# Altium schematic sheet Sheet1.SchDoc
size A
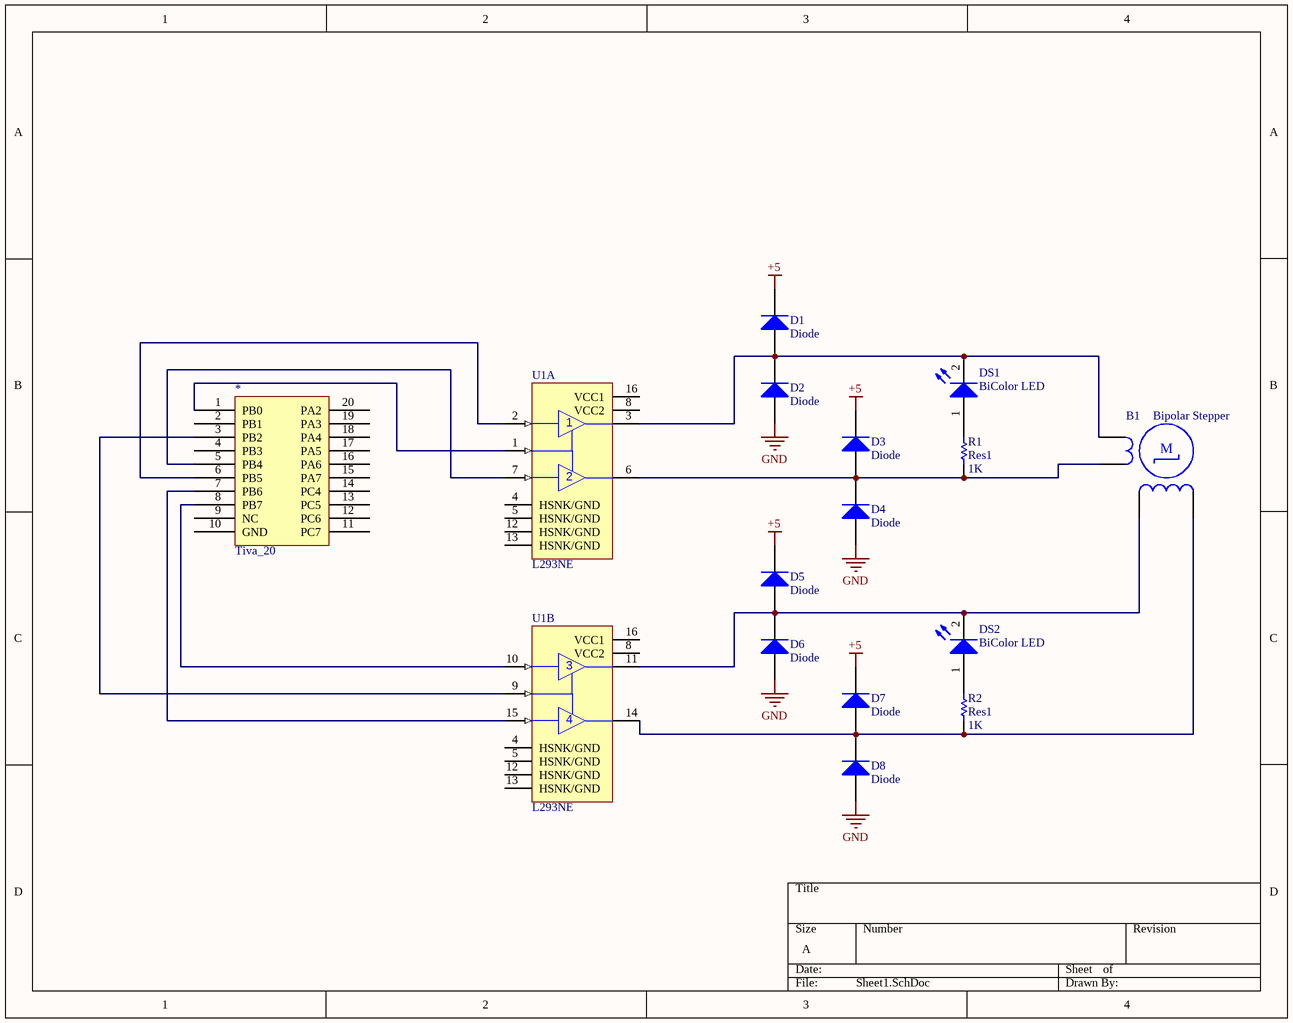
[diagram p0: Sheet1.SchDoc]

## Parts
*  Tiva_20
B1  Bipolar Stepper  [DIP-6]
D1  Diode  [DSO-C2/X3.3]
D2  Diode  [DSO-C2/X3.3]
D3  Diode  [DSO-C2/X3.3]
D4  Diode  [DSO-C2/X3.3]
D5  Diode  [DSO-C2/X3.3]
D6  Diode  [DSO-C2/X3.3]
D7  Diode  [DSO-C2/X3.3]
D8  Diode  [DSO-C2/X3.3]
DS1  BiColor LED  [LED-0]
DS2  BiColor LED  [LED-0]
R1  Res1  value 1K  [AXIAL-0.3]
R2  Res1  value 1K  [AXIAL-0.3]
U1  L293NE  [DIP-16/X1.5]  (parts A,B of 2)

## Nets
+5: D1.2(K) D3.2(K) D5.2(K) D7.2(K)
GND: D2.1(A) D4.1(A) D6.1(A) D8.1(A)
Net*_1: *.1(PB0) U1.1(1,2EN)
Net*_3: *.3(PB2) U1.9(3,4EN)
Net*_5: *.5(PB4) U1.7(2A)
Net*_6: *.6(PB5) U1.2(1A)
Net*_7: *.7(PB6) U1.15(4A)
Net*_8: *.8(PB7) U1.10(3A)
NetB1_1: B1.1 D1.1(A) D2.2(K) DS1.2(K) U1.3(1Y)
NetB1_3: B1.3 D3.1(A) D4.2(K) R1.1 U1.6(2Y)
NetB1_4: B1.4 D5.1(A) D6.2(K) DS2.2(K) U1.11(3Y)
NetB1_6: B1.6 D7.1(A) D8.2(K) R2.1 U1.14(4Y)
NetDS1_1: DS1.1(A) R1.2
NetDS2_1: DS2.1(A) R2.2

Not connected (* = marked no-connect by the designer): * 2(PB1) 4(PB3) 9(NC) 10(GND) 11(PC7) 12(PC6) 13(PC5) 14(PC4) 15(PA7) 16(PA6) 17(PA5) 18(PA4) 19(PA3) 20(PA2); U1 4(HSNK/GND) 5(HSNK/GND) 8(VCC2) 12(HSNK/GND) 13(HSNK/GND) 16(VCC1)

## Notes on the sheet
- (in symbol Motor Step 4Wire) M

## Library data of the parts
* = Tiva_20: Tiva Protection 20 Pin Connector
B1 = Motor Step 4Wire: Motor Stepper; Manufacturer: Generic Components; Published: 1999
D1-D8 = Diode: Default Diode; Manufacturer: Generic Components; Class: Discrete; SubClass: Diode - Switching; Published: 08/06/2000; Publisher: Altium Hobart Technology Centre
DS1 DS2 = LED0: Typical INFRARED GaAs LED; Manufacturer: Generic Components; Class: Optoelectronic; Published: 08/06/2000; Publisher: Altium Hobart Technology Centre; SubClass: LED
R1 R2 = Res1: Resistor; Manufacturer: Generic Components; Class: Passive; Published: 08/06/2000; Publisher: Altium Hobart Technology Centre; SubClass: Resistor
U1 = L293NE: Quadruple Half-H Driver; Manufacturer: Texas Instruments; Class: Interface; SubClass: Peripheral Driver; Published: 15/05/2002; Publisher: Altium Hobart Technology Centre